# Altium schematic sheet PhotoSensors.SchDoc
size A4
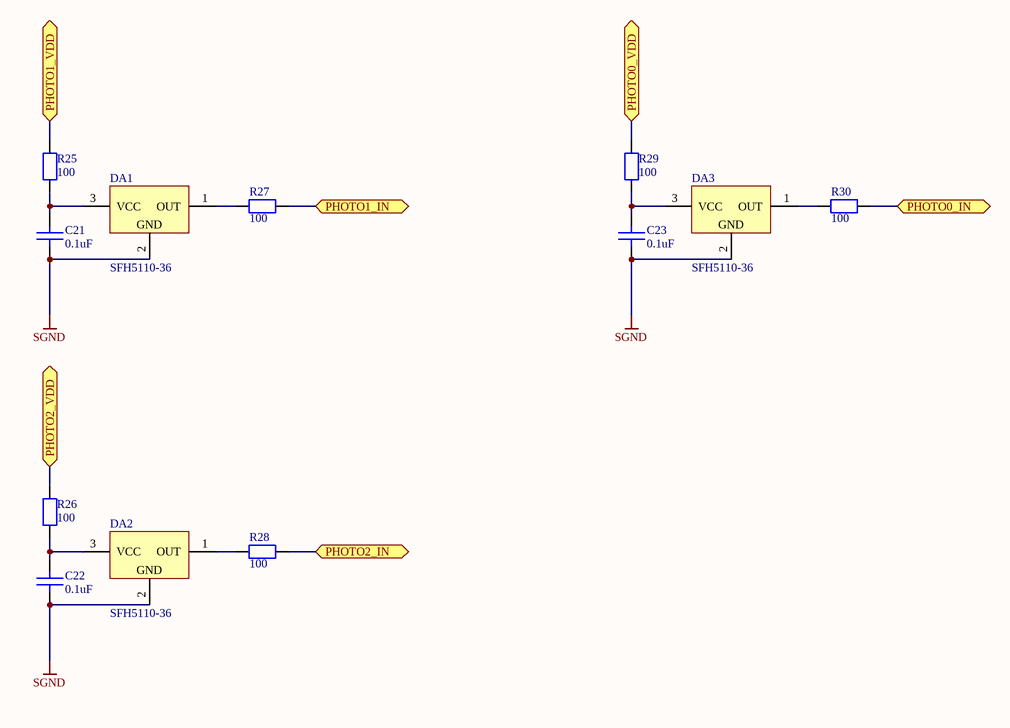
[diagram p0: PhotoSensors.SchDoc]

## Parts
C21  value 0.1uF  [C0805]  (hidden comment: C0.1uF-50V)
C22  value 0.1uF  [C0805]  (hidden comment: C0.1uF-50V)
C23  value 0.1uF  [C0805]  (hidden comment: C0.1uF-50V)
DA1  SFH5110-36  [SFH5110]
DA2  SFH5110-36  [SFH5110]
DA3  SFH5110-36  [SFH5110]
R25  value 100  [R0805]  (hidden comment: R100-5%)
R26  value 100  [R0805]  (hidden comment: R100-5%)
R27  value 100  [R0805]  (hidden comment: R100-5%)
R28  value 100  [R0805]  (hidden comment: R100-5%)
R29  value 100  [R0805]  (hidden comment: R100-5%)
R30  value 100  [R0805]  (hidden comment: R100-5%)

## Ports
PHOTO0_IN, PHOTO0_VDD, PHOTO1_IN, PHOTO1_VDD, PHOTO2_IN, PHOTO2_VDD

## Nets
SGND: C21.1 C22.1 C23.1 DA1.2(GND) DA2.2(GND) DA3.2(GND)
PHOTO0_IN: R30.1 ; port PHOTO0_IN
PHOTO0_VDD: R29.2 ; port PHOTO0_VDD
PHOTO1_IN: R27.1 ; port PHOTO1_IN
PHOTO1_VDD: R25.2 ; port PHOTO1_VDD
PHOTO2_IN: R28.1 ; port PHOTO2_IN
PHOTO2_VDD: R26.2 ; port PHOTO2_VDD
NetC21_2: C21.2 DA1.3(VCC) R25.1
NetC22_2: C22.2 DA2.3(VCC) R26.1
NetC23_2: C23.2 DA3.3(VCC) R29.1
NetDA1_1: DA1.1(OUT) R27.2
NetDA2_1: DA2.1(OUT) R28.2
NetDA3_1: DA3.1(OUT) R30.2

## Library data of the parts
C21-C23 = C0.1uF-50V: Type: Конденсатор керамический; Voltage: 50V; Name: C0.1uF-50V
DA1-DA3 = SFH5110-36: IR-Receiver; Value: 36kHz; Name: SFH5110-36; Type: ИК-приемник
R25-R30 = R100-5%: R-100-5%; Precision: 5%; Type: Резистор; Name: R100-5%